# EAGLE design converter (EAGLE 7.4.0)
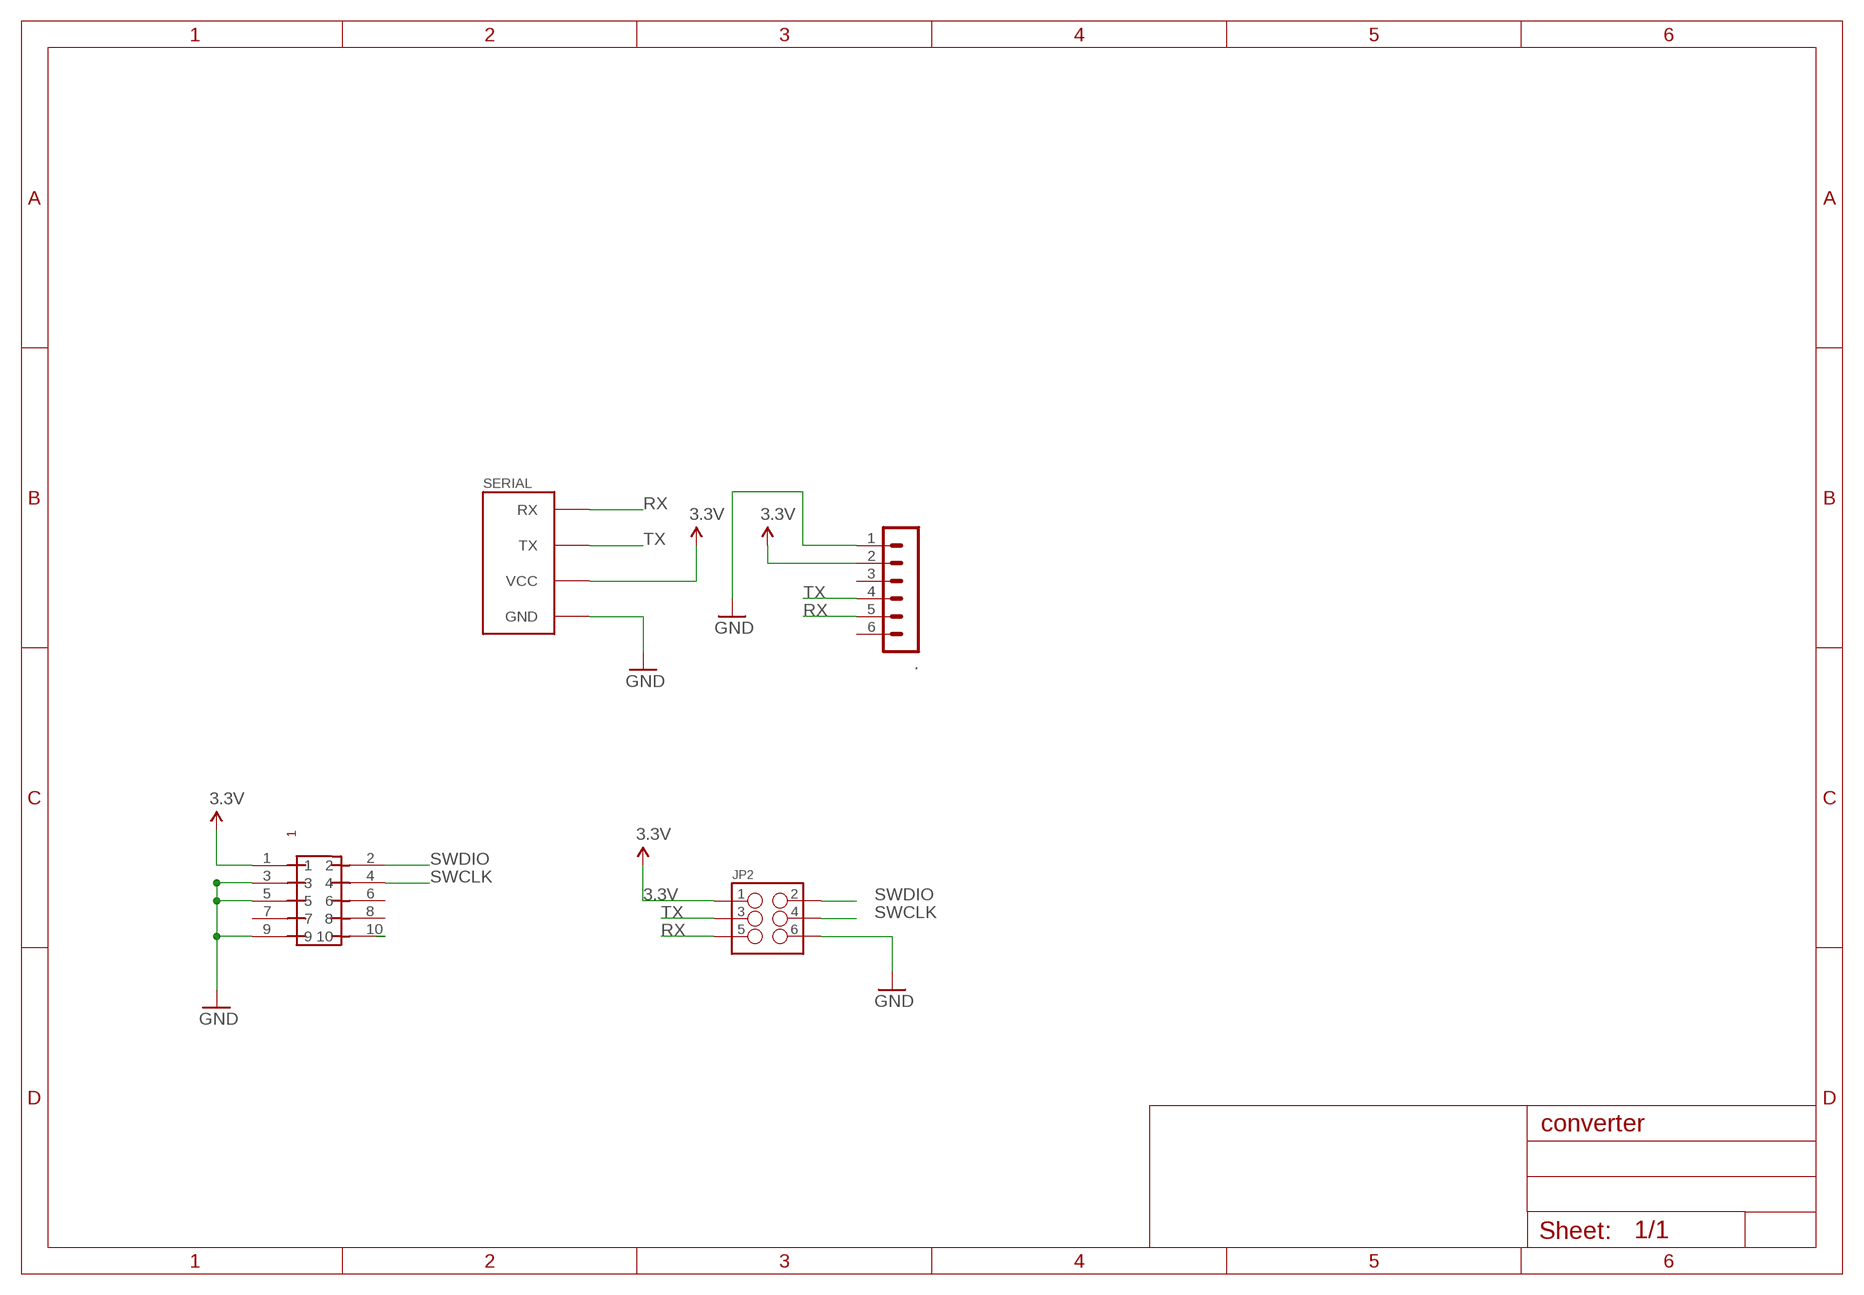
[diagram p0: schematic, sheet 1]

## Parts
.  MA06-1  [MA06-1]
JP2  M03X2  [2X3-SHROUDED]
SERIAL  FABO_BRICK_SERIAL-CONNECTOR_I  [FABO_BRICK_SERIAL_CONNECTOR_I]
U$5  PIN-HEADER-SMT(1.27MM)2X5  [PIN-HEADER-SMT(1.27MM)2X5]

## Nets
3.3V: ..2 JP2.1 SERIAL.VCC U$5.1
GND: ..1 JP2.6 SERIAL.GND U$5.3 U$5.5 U$5.9
RESET: U$5.10
RX: ..5 JP2.5 SERIAL.RX
SWCLK: JP2.4 U$5.4
SWDIO: JP2.2 U$5.2
TX: ..4 JP2.3 SERIAL.TX
Unconnected: ..3 ..6 U$5.6 U$5.7 U$5.8

## Library data of the parts
. = con-lstb:MA06-1: PIN HEADER; OC_FARNELL: unknown; OC_NEWARK: unknown
JP2 = SparkFun-Connectors:M03X2: 2x3 .1" header. Shrouded, with keying- CONN-10681 SMT- CONN-11415 Pogo pins- HW-11044; PROD_ID: CONN-10681
SERIAL = FaBo-Template:FABO_BRICK_SERIAL: FaBo Brick Serial
U$5 = GClue:PIN-HEADER-SMT(1.27MM)2X5: PIN-HEADER-SMT (1.27MM) 2x5

## Board
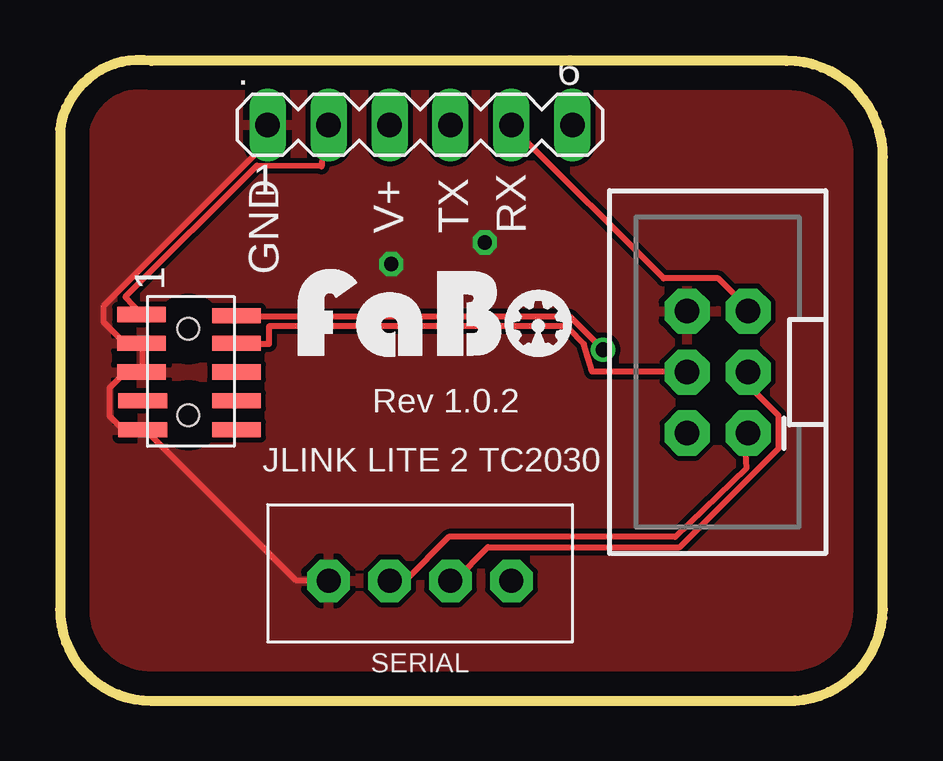
[diagram p1: board, top side]
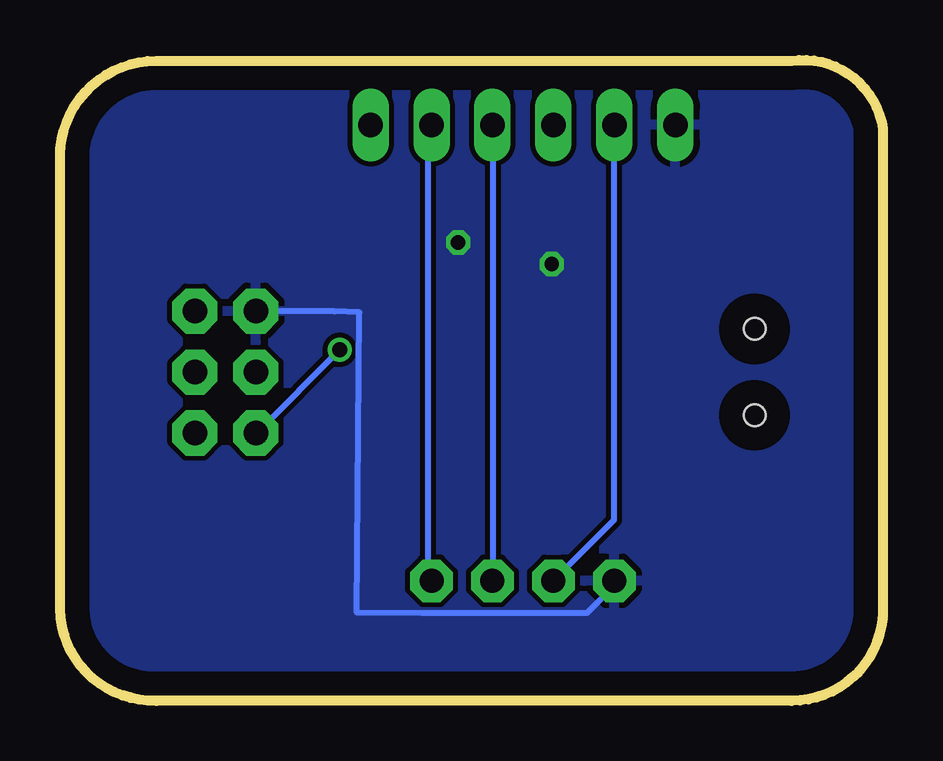
[diagram p2: board, bottom side, seen from below]

Size 34.29 x 26.7 mm. Coordinates in mm from the lower left corner, seen from the top.
Outline: 30.27,26.67 3.81,26.67 arc90 0,23.83 0,3.81 arc90 3.81,0 30.27,0 arc90 34.29,3.81 34.29,22.65 arc90 30.27,26.67
Copper layers (1*16): Top 0.035mm / dielectric 1.5mm / Bottom 0.035mm
Design rules "default": minimum track width 10mil, minimum drill 24mil, track to track 8mil, track to pad 8mil, pad to pad 8mil, via to via 8mil, smd to smd 8mil, copper to edge 40mil, drill to drill 8mil, minimum pad ring 10mil, minimum via ring 8mil, stop-mask expansion 4mil, vias tented up to drill 0mil, thermal gap 10mil

### Footprints (pad centres in the part's own frame; a part is rotated, then mirrored left to right if it is on the bottom)
MA06-1 = drill 1.016 long: 1 -6.35,0; 2 -3.81,0; 3 -1.27,0; 4 1.27,0; 5 3.81,0; 6 6.35,0
2X3-SHROUDED = drill 1.016 pad 1.88 octagon: 1 -1.27,2.54; 2 1.27,2.54; 3 -1.27,0; 4 1.27,0; 5 -1.27,-2.54; 6 1.27,-2.54
FABO_BRICK_SERIAL_CONNECTOR_I = drill 1 pad 1.778 octagon: GND -3.81,0; RX 3.81,0; TX 1.27,0; VCC -1.27,0
PIN-HEADER-SMT(1.27MM)2X5 = smd 0.635 x 2.032: 1 -2.4,-1.95; 2 -2.35,2; 3 -1.2,-1.95; 4 -1.2,2; 5 0,-1.95; 6 0,2; 7 1.2,-1.9; 8 1.2,2; 9 2.4,-1.9; 10 2.4,2 | hole 0.9: 1.8,0; -1.8,0

### Placement (x,y rotation side)
.  15,24 0 top
JP2  27.4,13.7 180 top
SERIAL  15,5 0 top
U$1  [LOGO_FABO_M]  15.63,14.34 0 top
U$5  5.35,13.7 270 top

### Tracks (layer width: path | path; a pad name or v marks a point on that pad's centre or on a via)
3.3V
  Top 0.254: U$5.1 2.73,16.83 8.2,22.3 10.9,22.27 10.97,23.77 ..2 | SERIAL.VCC 13.95,5.03 14.4,5.03 16.2,6.83 25.63,6.83 28.6,9.7 28.5,10.97 28.57,10.97 JP2.1
  Bottom 0.254: ..2 11.2,23.77 11.2,7.54 13.72,5.03 SERIAL.VCC
GND  (via drill 0.6)
  Top 0.254: ..1 8.46,23.77 8.46,23.09 1.83,16.46 1.83,15.77 2.52,15.09 3.2,15.09 U$5.3 3.43,14.86 3.43,13.72 U$5.5 3.2,13.49 2.52,13.49 2.06,13.03 2.06,11.89 2.52,11.43 3.43,11.43 U$5.9 3.66,11.2 9.83,5.03 10.97,5.03 SERIAL.GND
  Bottom 0.254: JP2.6 26.06,16.23 22.86,16.23 21.82,16.19 21.92,3.67 19.2,3.66 12.34,3.66 11.2,4.8 SERIAL.GND
  other vias: 13.8,18.2 17.7,19.1
  pour Top: -0.1,0 34.6,0 34.6,27.2 -0.2,27.2 -0.2,0
  pour Bottom: 0.1,0 34.5,0 34.5,27 -0.1,27 -0.1,0
RX
  Top 0.254: ..5 18.97,23.77 25.15,17.6 27.43,17.6 28.57,16.46 JP2.5
  Bottom 0.254: SERIAL.RX 18.97,5.03 18.97,23.77 ..5
SWCLK
  Top 0.254: U$5.4 7.54,14.86 8.7,14.86 8.7,15.6 21.2,15.6 21.2,15.5 21.83,14.86 22.17,13.72 26.06,13.72 JP2.4
SWDIO  (via drill 0.61)
  Top 0.254: v22.63,14.63 21.26,16 7.54,16 U$5.2
  Bottom 0.254: v22.63,14.63 26.06,11.2 JP2.2
TX
  Top 0.254: JP2.3 28.8,13.49 28.8,13.03 29.95,11.89 29.95,10.52 25.83,6.4 17.83,6.4 16.46,5.03 SERIAL.TX
  Bottom 0.254: ..4 16.23,23.77 16.23,5.03 SERIAL.TX

### Text on the board
tPlace: V+ | TX | RX | GND | Rev 1.0.2 | JLINK LITE 2 TC2030